# EAGLE design pcb-pick-plaz-hall v1 (EAGLE 9.6.2)
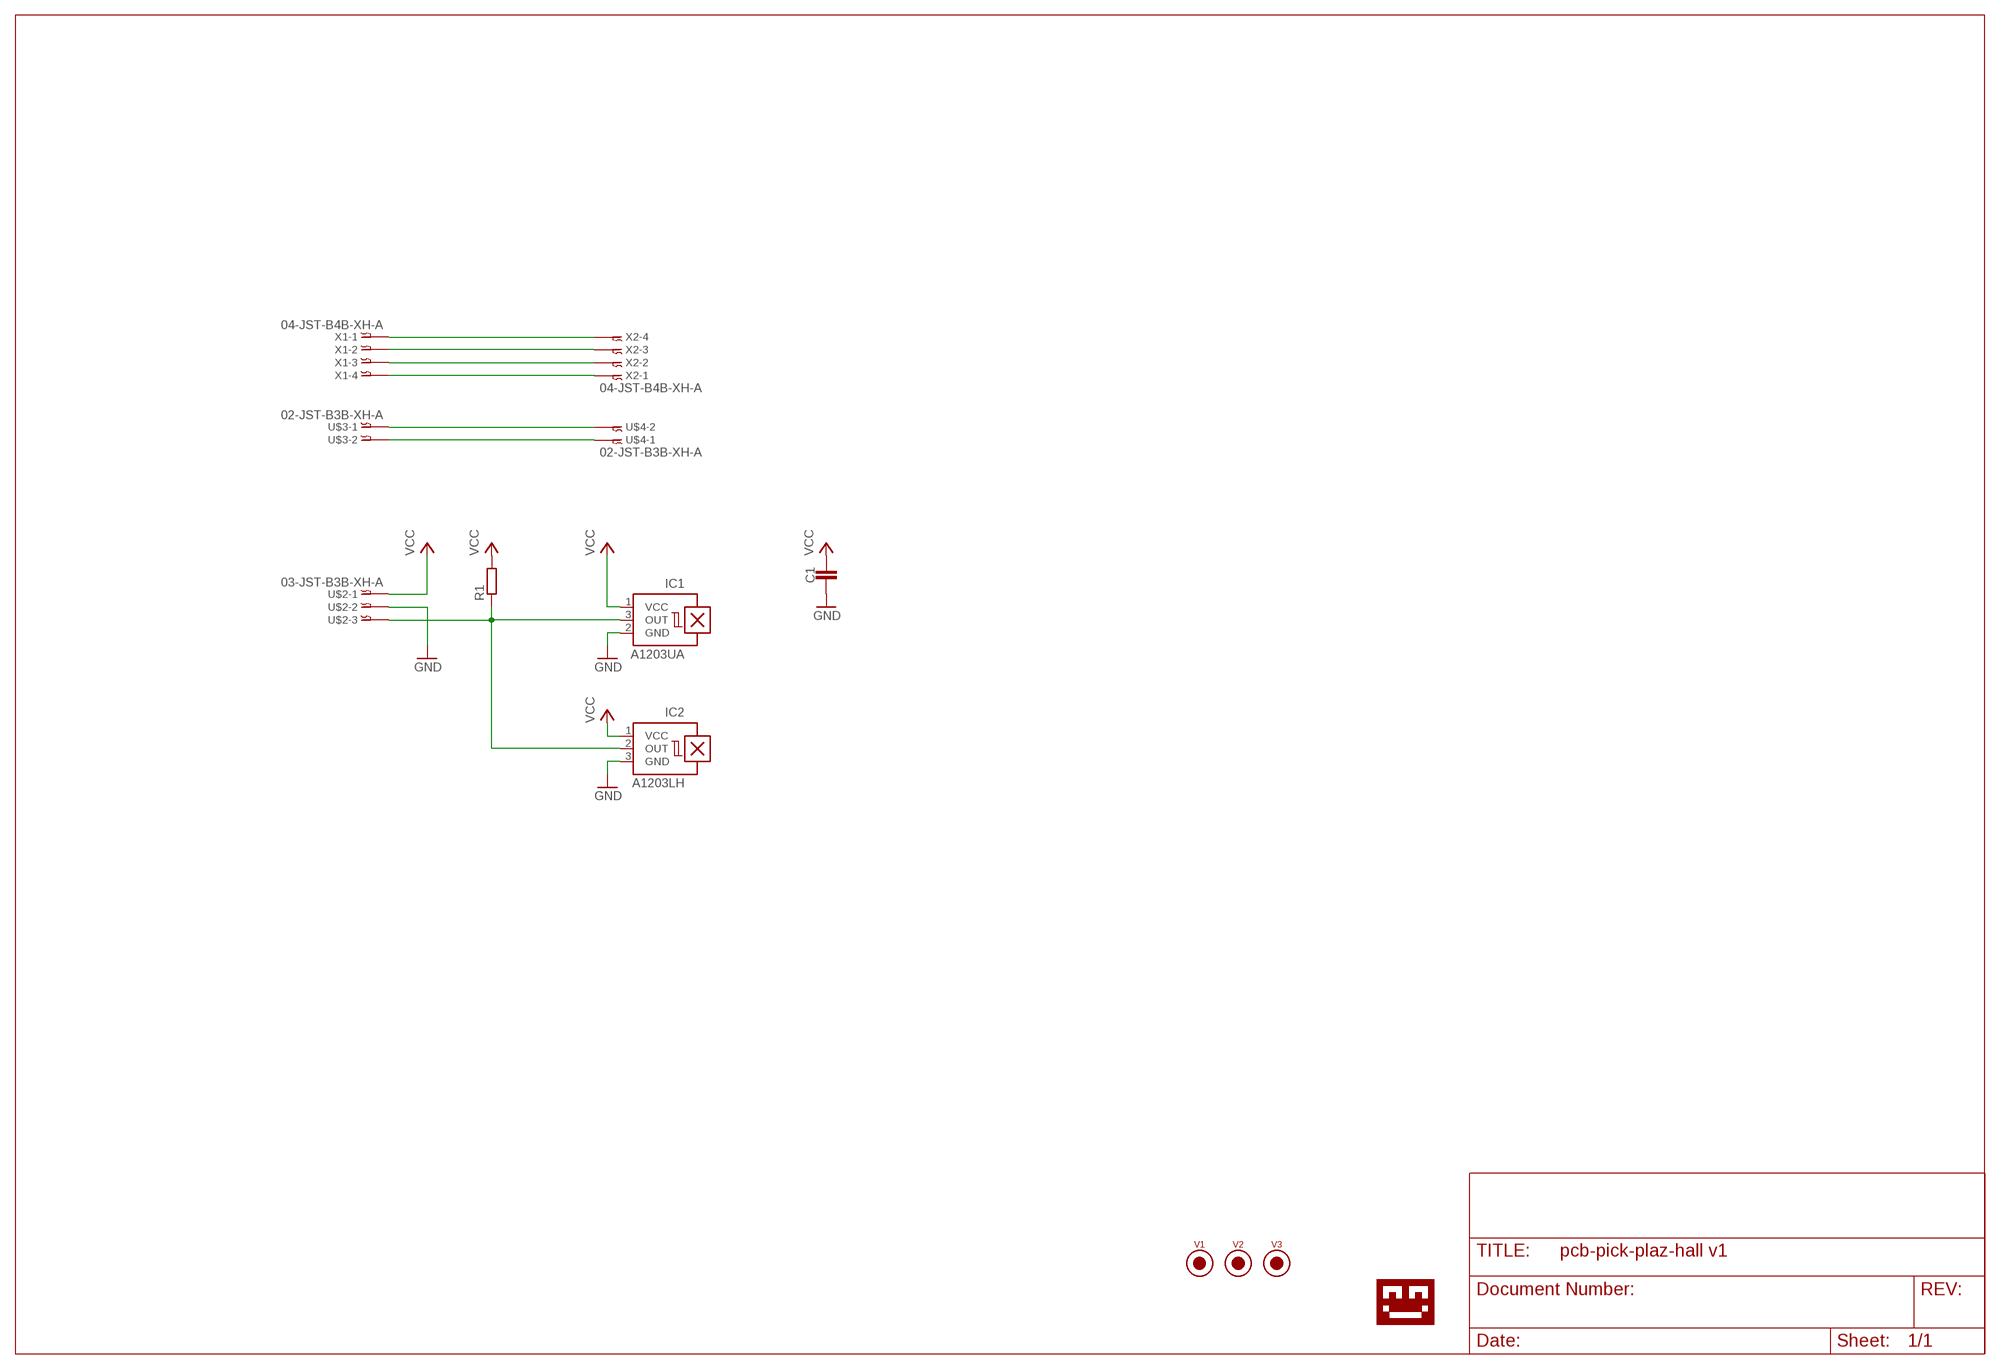
[diagram p0: schematic, sheet 1]

## Parts
C1  CAPACITOR0603_CAP  [0603_CAP]
IC1  A1203UA  [SIP3-UA]
IC2  A1203LH  [SOT23-W]
R1  RESISTOR0603_RES  [0603-RES]
U$1  LOGO-TOBENG-1MM  [TOBENG-1MM]
U$2  03-JST-B3B-XH-A  [B3B-XH]
U$3  02-JST-B3B-XH-A  [B2B-XH]
U$4  02-JST-B3B-XH-A  [B2B-XH]
V1  FIDUCIAL2MM  [FIDUCIAL_2MM]
V2  FIDUCIAL2MM  [FIDUCIAL_2MM]
V3  FIDUCIAL2MM  [FIDUCIAL_2MM]
X1  04-JST-B4B-XH-A  [B4B-XH]
X2  04-JST-B4B-XH-A  [B4B-XH]

## Nets
GND: C1.2 IC1.2(GND) IC2.3(GND) U$2.P$2
N$1: X1.P$1 X2.P$4
N$2: X1.P$2 X2.P$3
N$3: X1.P$3 X2.P$2
N$4: X1.P$4 X2.P$1
N$5: U$3.P$1 U$4.P$2
N$6: U$3.P$2 U$4.P$1
N$7: IC1.3(OUT) IC2.2(OUT) R1.1 U$2.P$3
VCC: C1.1 IC1.1(VCC) IC2.1(VCC) R1.2 U$2.P$1

## Library data of the parts
C1 = passives:CAPACITOR: SMD Capacitor
IC1 = allegro:A12*?: Hall-effect bipolar switch Source: http://www.allegromicro.com/en/Products/Part_Numbers/1202/1202.pdf; OC_FARNELL: 1521672; OC_NEWARK: unknown
IC2 = allegro:A12*?: Hall-effect bipolar switch Source: http://www.allegromicro.com/en/Products/Part_Numbers/1202/1202.pdf; MF: ALLEGRO MICROSYSTEMS, INC.; MPN: A1203LLHLT-T; OC_FARNELL: 1791384; OC_NEWARK: 31K6608
R1 = passives:RESISTOR: Resistor Basic schematic elements and footprints for 0201, 0402, 0603, 1206, and PTH resistors.
U$1 = ftobler:LOGO
U$2 = bt_con-jst-xh:03-JST: JST CONNECTOR
U$3 U$4 = bt_con-jst-xh:02-JST: JST CONNECTOR
V1-V3 = ftobler:FIDUCIAL
X1 X2 = bt_con-jst-xh:04-JST: JST CONNECTOR

## Board
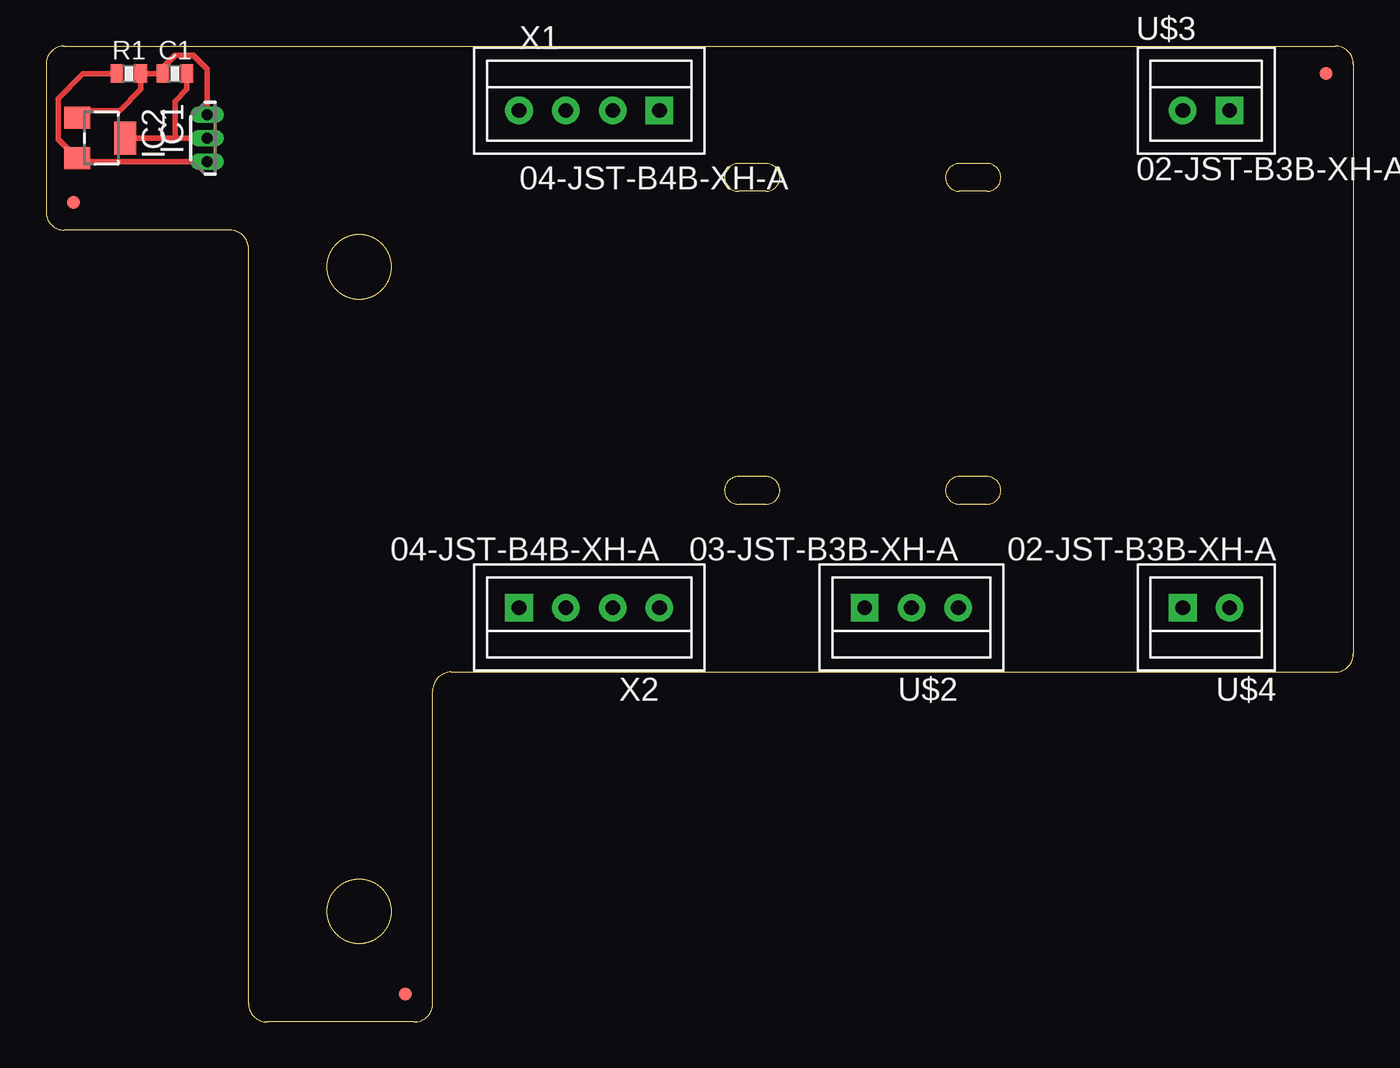
[diagram p1: board, top side]
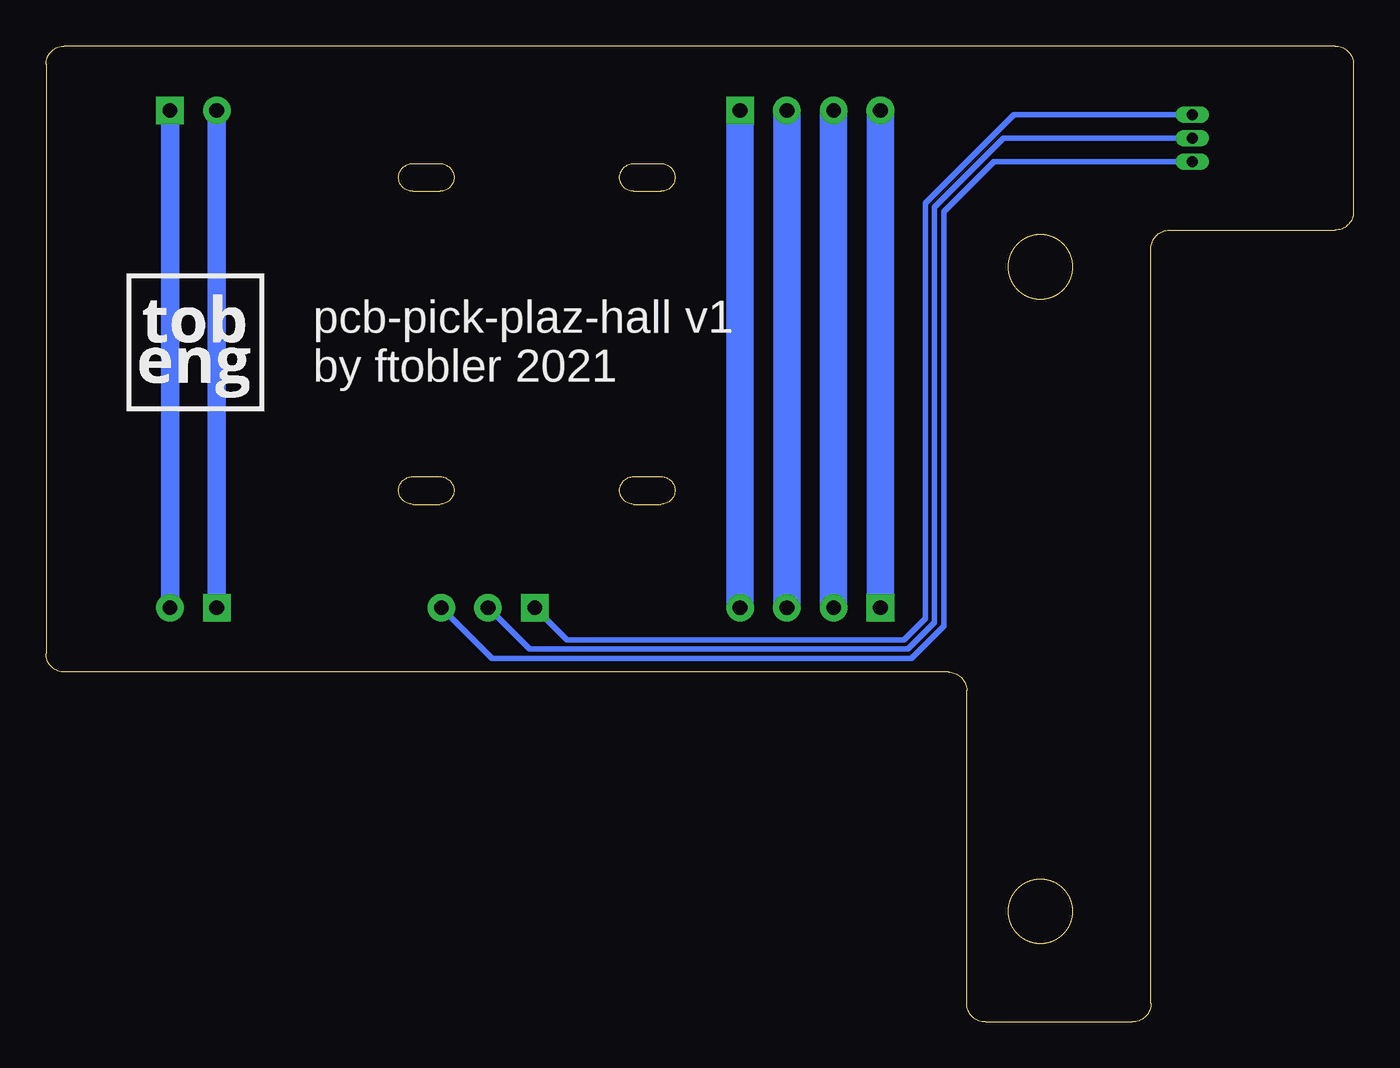
[diagram p2: board, bottom side, seen from below]

Size 71 x 53 mm. Coordinates in mm from the lower left corner, seen from the top.
Outline: 71,52 71,20 arc-90 70,19 22,19 arc90 21,18 21,1 arc-90 20,0 12,0 arc-90 11,1 11,42 arc90 10,43 1,43 arc-90 0,44 0,52 arc-90 1,53 70,53 arc-90 71,52
Outline: 39.1,46.61 37.6,46.61 arc180 37.6,45.11 39.1,45.11 arc180 39.1,46.61
Outline: 51.1,46.61 49.6,46.61 arc180 49.6,45.11 51.1,45.11 arc180 51.1,46.61
Outline: 39.1,29.61 37.6,29.61 arc180 37.6,28.11 39.1,28.11 arc180 39.1,29.61
Outline: 51.1,29.61 49.6,29.61 arc180 49.6,28.11 51.1,28.11 arc180 51.1,29.61
Outline: circle at 17,41 radius 1.75
Outline: circle at 17,6 radius 1.75
Copper layers (1*16): Top 0.035mm / dielectric 1.5mm / Bottom 0.035mm
Design rules "default *": minimum track width 0.2mm, minimum drill 0.3mm, track to track 0.2mm, track to pad 0.2mm, pad to pad 0.2mm, via to via 0.2mm, smd to smd 0.2mm, copper to edge 0.3mm, drill to drill 10mil, minimum pad ring 0.15mm, minimum via ring 0.15mm, stop-mask expansion 0.05mm, vias tented up to drill 0.35mm, thermal gap 0.2mm

### Footprints (pad centres in the part's own frame; a part is rotated, then mirrored left to right if it is on the bottom)
0603_CAP = smd 0.7 x 1: 1 -0.65,0; 2 0.65,0
SIP3-UA = drill 0.6 pad 0.7 long: 1 -1.27,0; 2 0,0; 3 1.27,0
SOT23-W = smd 1.2 x 1.4: 1 -1.1,-1.3; 2 1.1,-1.3 | smd 1.8 x 1.2: 3 0,1.3
0603-RES = smd 0.7 x 1: 1 -0.65,0; 2 0.65,0
B3B-XH = drill 0.8 pad 1.5 square: P$1 2.54,0 | drill 0.8 pad 1.5: P$2 0,0; P$3 -2.54,0
B2B-XH = drill 0.8 pad 1.5 square: P$1 1.27,0 | drill 0.8 pad 1.5: P$2 -1.27,0
FIDUCIAL_2MM = smd 0.7 x 0.7: V 0,0
B4B-XH = drill 0.8 pad 1.5 square: P$1 3.81,0 | drill 0.8 pad 1.5: P$2 1.27,0; P$3 -1.27,0; P$4 -3.81,0

### Placement (x,y rotation side)
C1  7,51.5 0 top
IC1  8.75,48 270 top
IC2  3,48 270 top
R1  4.5,51.5 0 top
U$1  62.9,36.9 0 bottom
U$2  47,22.5 180 top
U$3  63,49.5 0 top
U$4  63,22.5 180 top
V1  1.5,44.5 0 top
V2  19.5,1.5 0 top
V3  69.5,51.5 0 top
X1  29.5,49.5 0 top
X2  29.5,22.5 180 top

### Tracks (layer width: path | path; a pad name or v marks a point on that pad's centre or on a via)
GND
  Top 0.3: IC2.3 7,48 | 7,48 IC1.2 | C1.2 7.65,50.65 7,50 7,48
  Bottom 0.3: IC1.2 19,48 22.75,44.25 22.75,21.71 24.21,20.25 44.75,20.25 U$2.P$2
N$1
  Bottom 1.5: X1.P$1 X2.P$4
N$2
  Bottom 1.5: X1.P$2 X2.P$3
N$3
  Bottom 1.5: X1.P$3 X2.P$2
N$4
  Bottom 1.5: X1.P$4 X2.P$1
N$5
  Bottom 1: U$4.P$2 U$3.P$1
N$6
  Bottom 1: U$3.P$2 U$4.P$1
N$7
  Top 0.3: R1.1 2,51.5 0.65,50.15 0.65,47.95 IC2.2 1.87,46.73 IC1.3
  Bottom 0.3: IC1.3 19.52,46.73 22.25,44 22.25,21.5 24,19.75 46.79,19.75 U$2.P$3
VCC
  Top 0.3: IC2.1 1.7,49.45 1.75,49.5 4,49.5 5.15,50.65 R1.2 C1.1 6.35,51.85 7,52.5 8,52.5 8.75,51.75 IC1.1
  Bottom 0.3: IC1.1 18.44,49.27 23.25,44.46 23.25,21.91 24.41,20.75 42.71,20.75 U$2.P$1

### Text on the board
bPlace: pcb-pick-plaz-hall v1 / by ftobler 2021
tStop: V3 | V1 | V2